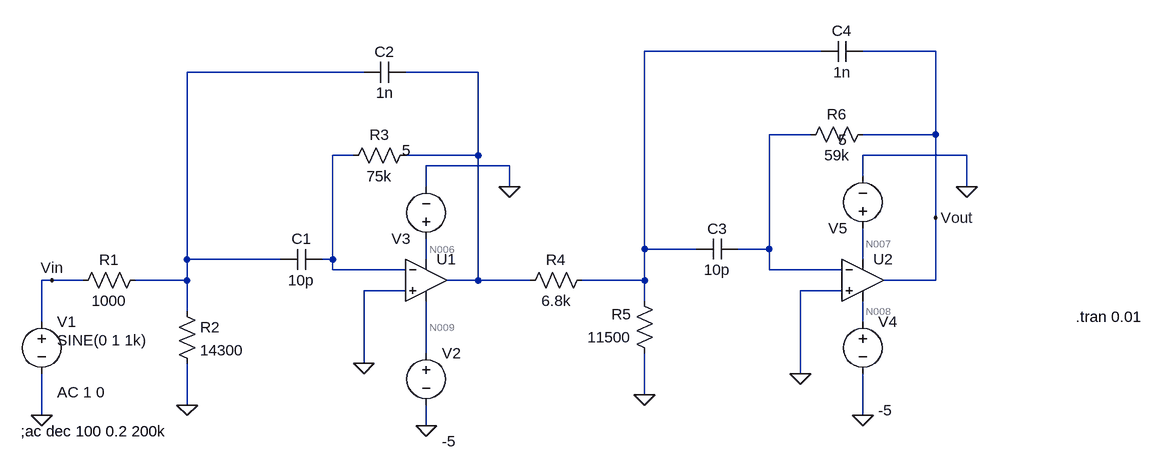
[diagram p0: schematic Draft1.asc]
Draft1.asc, the LTspice schematic file:
Version 4
SHEET 1 1580 680
WIRE 1072 -208 800 -208
WIRE 1248 -208 1136 -208
WIRE 368 -176 96 -176
WIRE 544 -176 432 -176
WIRE 1056 -80 992 -80
WIRE 1248 -80 1248 -208
WIRE 1248 -80 1136 -80
WIRE 352 -48 320 -48
WIRE 544 -48 544 -176
WIRE 544 -48 432 -48
WIRE 1296 -48 1136 -48
WIRE 592 -32 464 -32
WIRE 1136 -16 1136 -48
WIRE 464 0 464 -32
WIRE 592 0 592 -32
WIRE 1296 0 1296 -48
WIRE 1248 48 1248 -80
WIRE 800 96 800 -208
WIRE 880 96 800 96
WIRE 992 96 992 -80
WIRE 992 96 944 96
WIRE 96 112 96 -176
WIRE 240 112 96 112
WIRE 320 112 320 -48
WIRE 320 112 304 112
WIRE 464 112 464 80
WIRE 1136 112 1136 64
WIRE 320 128 320 112
WIRE 432 128 320 128
WIRE 992 128 992 96
WIRE 1104 128 992 128
WIRE -112 144 -128 144
WIRE -64 144 -112 144
WIRE 96 144 96 112
WIRE 96 144 16 144
WIRE 544 144 544 -48
WIRE 544 144 496 144
WIRE 624 144 544 144
WIRE 800 144 800 96
WIRE 800 144 704 144
WIRE 1248 144 1248 48
WIRE 1248 144 1168 144
WIRE 432 160 368 160
WIRE 1104 160 1040 160
WIRE 800 176 800 144
WIRE 96 192 96 144
WIRE -128 208 -128 144
WIRE 1136 208 1136 176
WIRE 464 256 464 176
WIRE 368 272 368 160
WIRE 1040 288 1040 160
WIRE 800 320 800 256
WIRE 96 336 96 272
WIRE -128 352 -128 288
WIRE 1136 352 1136 288
WIRE 464 368 464 336
FLAG 96 336 0
FLAG 368 272 0
FLAG 800 320 0
FLAG 1040 288 0
FLAG -128 352 0
FLAG 1248 48 Vout
FLAG -112 144 Vin
FLAG 464 368 0
FLAG 1136 352 0
FLAG 592 0 0
FLAG 1296 0 0
DATAFLAG 464 96 ""
DATAFLAG 464 224 ""
DATAFLAG 1136 192 ""
DATAFLAG 1136 80 ""
SYMBOL res 32 128 R90
WINDOW 0 0 56 VBottom 2
WINDOW 3 32 56 VTop 2
SYMATTR InstName R1
SYMATTR Value 1000
SYMBOL res 80 176 R0
SYMATTR InstName R2
SYMATTR Value 14300
SYMBOL cap 304 96 R90
WINDOW 0 0 32 VBottom 2
WINDOW 3 32 32 VTop 2
SYMATTR InstName C1
SYMATTR Value 10p
SYMBOL res 448 -64 R90
WINDOW 0 0 56 VBottom 2
WINDOW 3 32 56 VTop 2
SYMATTR InstName R3
SYMATTR Value 75k
SYMBOL cap 432 -192 R90
WINDOW 0 0 32 VBottom 2
WINDOW 3 32 32 VTop 2
SYMATTR InstName C2
SYMATTR Value 1n
SYMBOL res 720 128 R90
WINDOW 0 0 56 VBottom 2
WINDOW 3 32 56 VTop 2
SYMATTR InstName R4
SYMATTR Value 6.8k
SYMBOL res 816 272 R180
WINDOW 0 36 76 Left 2
WINDOW 3 36 40 Left 2
SYMATTR InstName R5
SYMATTR Value 11500
SYMBOL cap 944 80 R90
WINDOW 0 0 32 VBottom 2
WINDOW 3 32 32 VTop 2
SYMATTR InstName C3
SYMATTR Value 10p
SYMBOL res 1152 -96 R90
WINDOW 0 0 56 VBottom 2
WINDOW 3 32 56 VTop 2
SYMATTR InstName R6
SYMATTR Value 59k
SYMBOL cap 1136 -224 R90
WINDOW 0 0 32 VBottom 2
WINDOW 3 32 32 VTop 2
SYMATTR InstName C4
SYMATTR Value 1n
SYMBOL OpAmps\\UniversalOpAmp 1136 144 R0
SYMATTR InstName U2
SYMBOL voltage -128 192 R0
WINDOW 123 24 124 Left 2
WINDOW 39 0 0 Left 0
WINDOW 3 24 44 Left 2
SYMATTR Value2 AC 1 0
SYMATTR Value SINE(0 1 1k)
SYMATTR InstName V1
SYMBOL voltage 464 240 R0
WINDOW 3 24 152 Left 2
WINDOW 123 24 124 Left 2
WINDOW 39 0 0 Left 0
SYMATTR Value -5
SYMATTR InstName V2
SYMBOL voltage 1136 192 R0
WINDOW 3 24 152 Left 2
WINDOW 123 24 124 Left 2
WINDOW 39 0 0 Left 0
SYMATTR Value -5
SYMATTR InstName V4
SYMBOL voltage 464 96 R180
WINDOW 3 24 152 Left 2
WINDOW 123 24 124 Left 2
WINDOW 39 0 0 Left 0
SYMATTR Value 5
SYMATTR InstName V3
SYMBOL voltage 1136 80 R180
WINDOW 3 24 152 Left 2
WINDOW 123 24 124 Left 2
WINDOW 39 0 0 Left 0
SYMATTR Value 5
SYMATTR InstName V5
SYMBOL OpAmps\\UniversalOpAmp 464 144 R0
SYMATTR InstName U1
TEXT -160 376 Left 2 !;ac dec 100 0.2 200k
TEXT 1464 200 Left 2 !.tran 0.01

The netlist it stands for:
* Draft1.asc
R1 N002 Vin 1000
R2 N002 0 14300
C1 N005 N002 10p
R3 N003 N005 75k
C2 N003 N002 1n
R4 N001 N003 6.8k
R5 0 N001 11500
C3 N004 N001 10p
R6 Vout N004 59k
C4 Vout N001 1n
XU2 0 N004 N007 N008 Vout level1 Avol=1Meg GBW=10Meg Vos=0 En=0 Enk=0 In=0 Ink=0 Rin=500Meg  ; pins In+ In- V+ V- OUT
V1 Vin 0 SINE(0 1 1k) AC 1 0
V2 N009 0 -5
V4 N008 0 -5
V3 N006 0 5
V5 N007 0 5
XU1 0 N005 N006 N009 N003 level1 Avol=1Meg GBW=10Meg Vos=0 En=0 Enk=0 In=0 Ink=0 Rin=500Meg  ; pins In+ In- V+ V- OUT
;ac dec 100 0.2 200k
.tran 0.01
.lib UniversalOpAmp1.lib
.backanno
.end

* Results of the author's LTspice run, read from the files saved beside the schematic
* Operating Point, zero values left out:
*   V(n007) = 5 V
*   V(n008) = -5 V
*   V(n009) = -5 V
*   V(n006) = 5 V
*   I(V5) = -10 nA
*   I(V3) = -10 nA
*   I(V4) = 10 nA
*   I(V2) = 10 nA
*   Ix(u2:3) = 10 nA
*   Ix(u2:4) = -10 nA
*   Ix(u1:3) = 10 nA
*   Ix(u1:4) = -10 nA
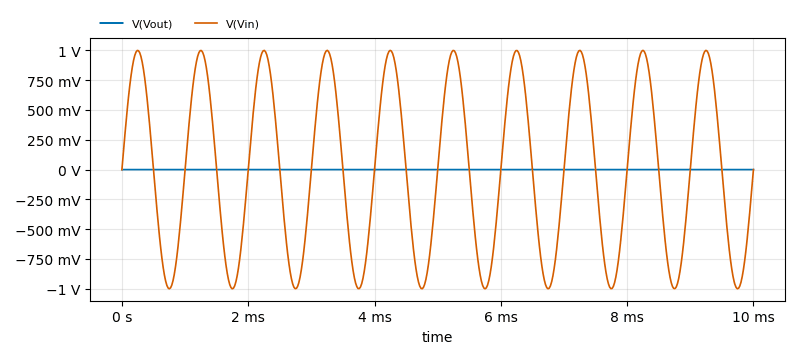
[diagram p1: Transient Analysis of Draft1.asc, plotted from the saved traces]
* Transient Analysis, 1 run:
*   V(Vout): min -10.25 µV, max 300.8 µV, average 167.3 nV, rms 9.153 µV, last 318.1 nV
*   V(Vin): min -1 V, max 1 V, average -582.1 nV, rms 707.1 mV, last 0 V